# Altium schematic sheet GraviTE_TOP.SchDoc
size A4; SheetNumber: 1; SheetTotal: 7
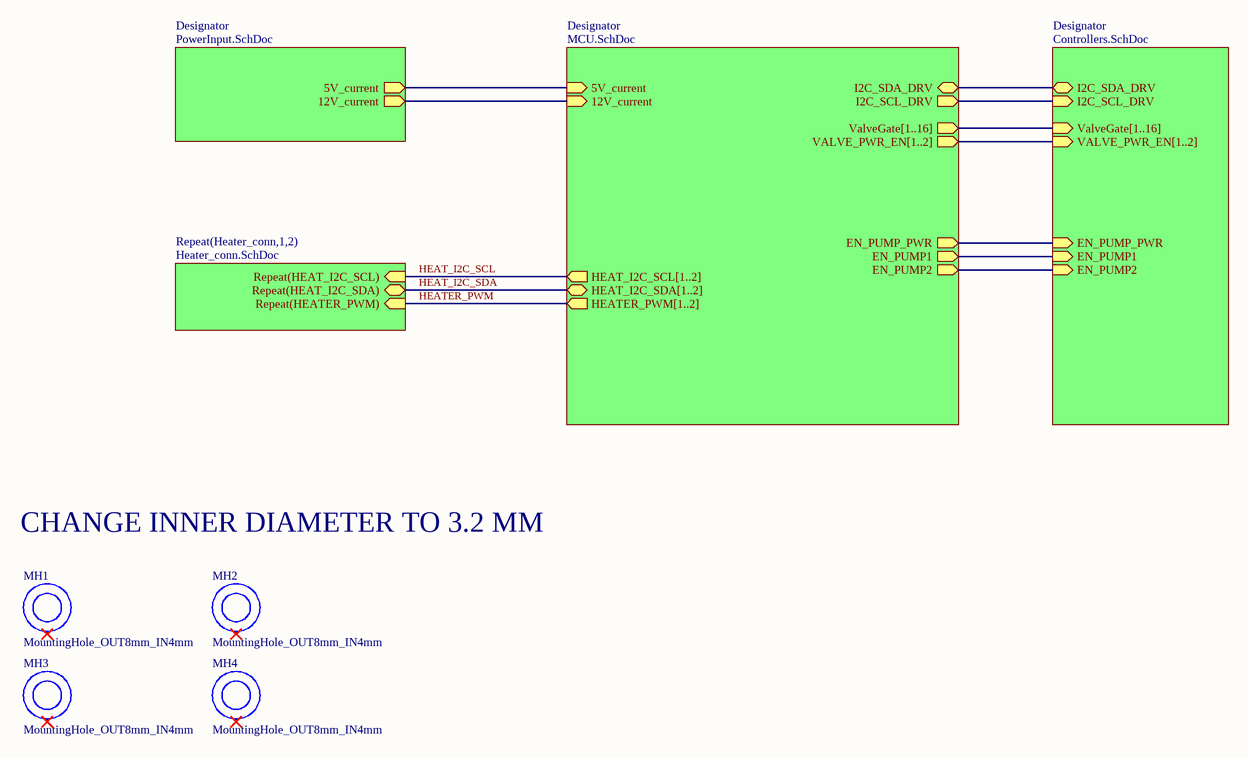
[diagram p0: GraviTE_TOP.SchDoc]

## Parts
MH1  MountingHole_OUT8mm_IN4mm  [MountingHole_OUT8mm_IN4mm]
MH2  MountingHole_OUT8mm_IN4mm  [MountingHole_OUT8mm_IN4mm]
MH3  MountingHole_OUT8mm_IN4mm  [MountingHole_OUT8mm_IN4mm]
MH4  MountingHole_OUT8mm_IN4mm  [MountingHole_OUT8mm_IN4mm]

## Sub-sheets
Designator = PowerInput.SchDoc: 5V_current (out), 12V_current (out)
Designator = MCU.SchDoc: EN_PUMP_PWR (out), EN_PUMP1 (out), EN_PUMP2 (out), 12V_current (in), 5V_current (in), HEAT_I2C_SCL[1..2] (out), HEAT_I2C_SDA[1..2] (bidir), HEATER_PWM[1..2] (out), ValveGate[1..16] (out), VALVE_PWR_EN[1..2] (out), I2C_SDA_DRV (bidir), I2C_SCL_DRV (out)
Designator = Controllers.SchDoc: EN_PUMP_PWR (in), EN_PUMP1 (in), EN_PUMP2 (in), ValveGate[1..16] (in), VALVE_PWR_EN[1..2] (in), I2C_SDA_DRV (bidir), I2C_SCL_DRV (in)
Repeat(Heater_conn,1,2) = Heater_conn.SchDoc: Repeat(HEAT_I2C_SCL) (in), Repeat(HEAT_I2C_SDA) (bidir), Repeat(HEATER_PWM) (in)

## Nets
HEAT_I2C_SCL: sheet Repeat(Heater_conn,1,2)/Repeat(HEAT_I2C_SCL)
HEAT_I2C_SDA: sheet Repeat(Heater_conn,1,2)/Repeat(HEAT_I2C_SDA)
HEATER_PWM: sheet Repeat(Heater_conn,1,2)/Repeat(HEATER_PWM)
(unnamed): sheet Designator/5V_current, sheet Designator/5V_current
(unnamed): sheet Designator/12V_current, sheet Designator/12V_current
(unnamed): sheet Designator/EN_PUMP_PWR, sheet Designator/EN_PUMP_PWR
(unnamed): sheet Designator/EN_PUMP1, sheet Designator/EN_PUMP1
(unnamed): sheet Designator/EN_PUMP2, sheet Designator/EN_PUMP2
(unnamed): sheet Designator/I2C_SDA_DRV, sheet Designator/I2C_SDA_DRV
(unnamed): sheet Designator/I2C_SCL_DRV, sheet Designator/I2C_SCL_DRV

Not connected (* = marked no-connect by the designer): MH1 1*; MH2 1*; MH3 1*; MH4 1*

## Notes on the sheet
- CHANGE INNER DIAMETER TO 3.2 MM